# EAGLE design Dot (EAGLE 7.7.0)

## Sheet 1 of 2
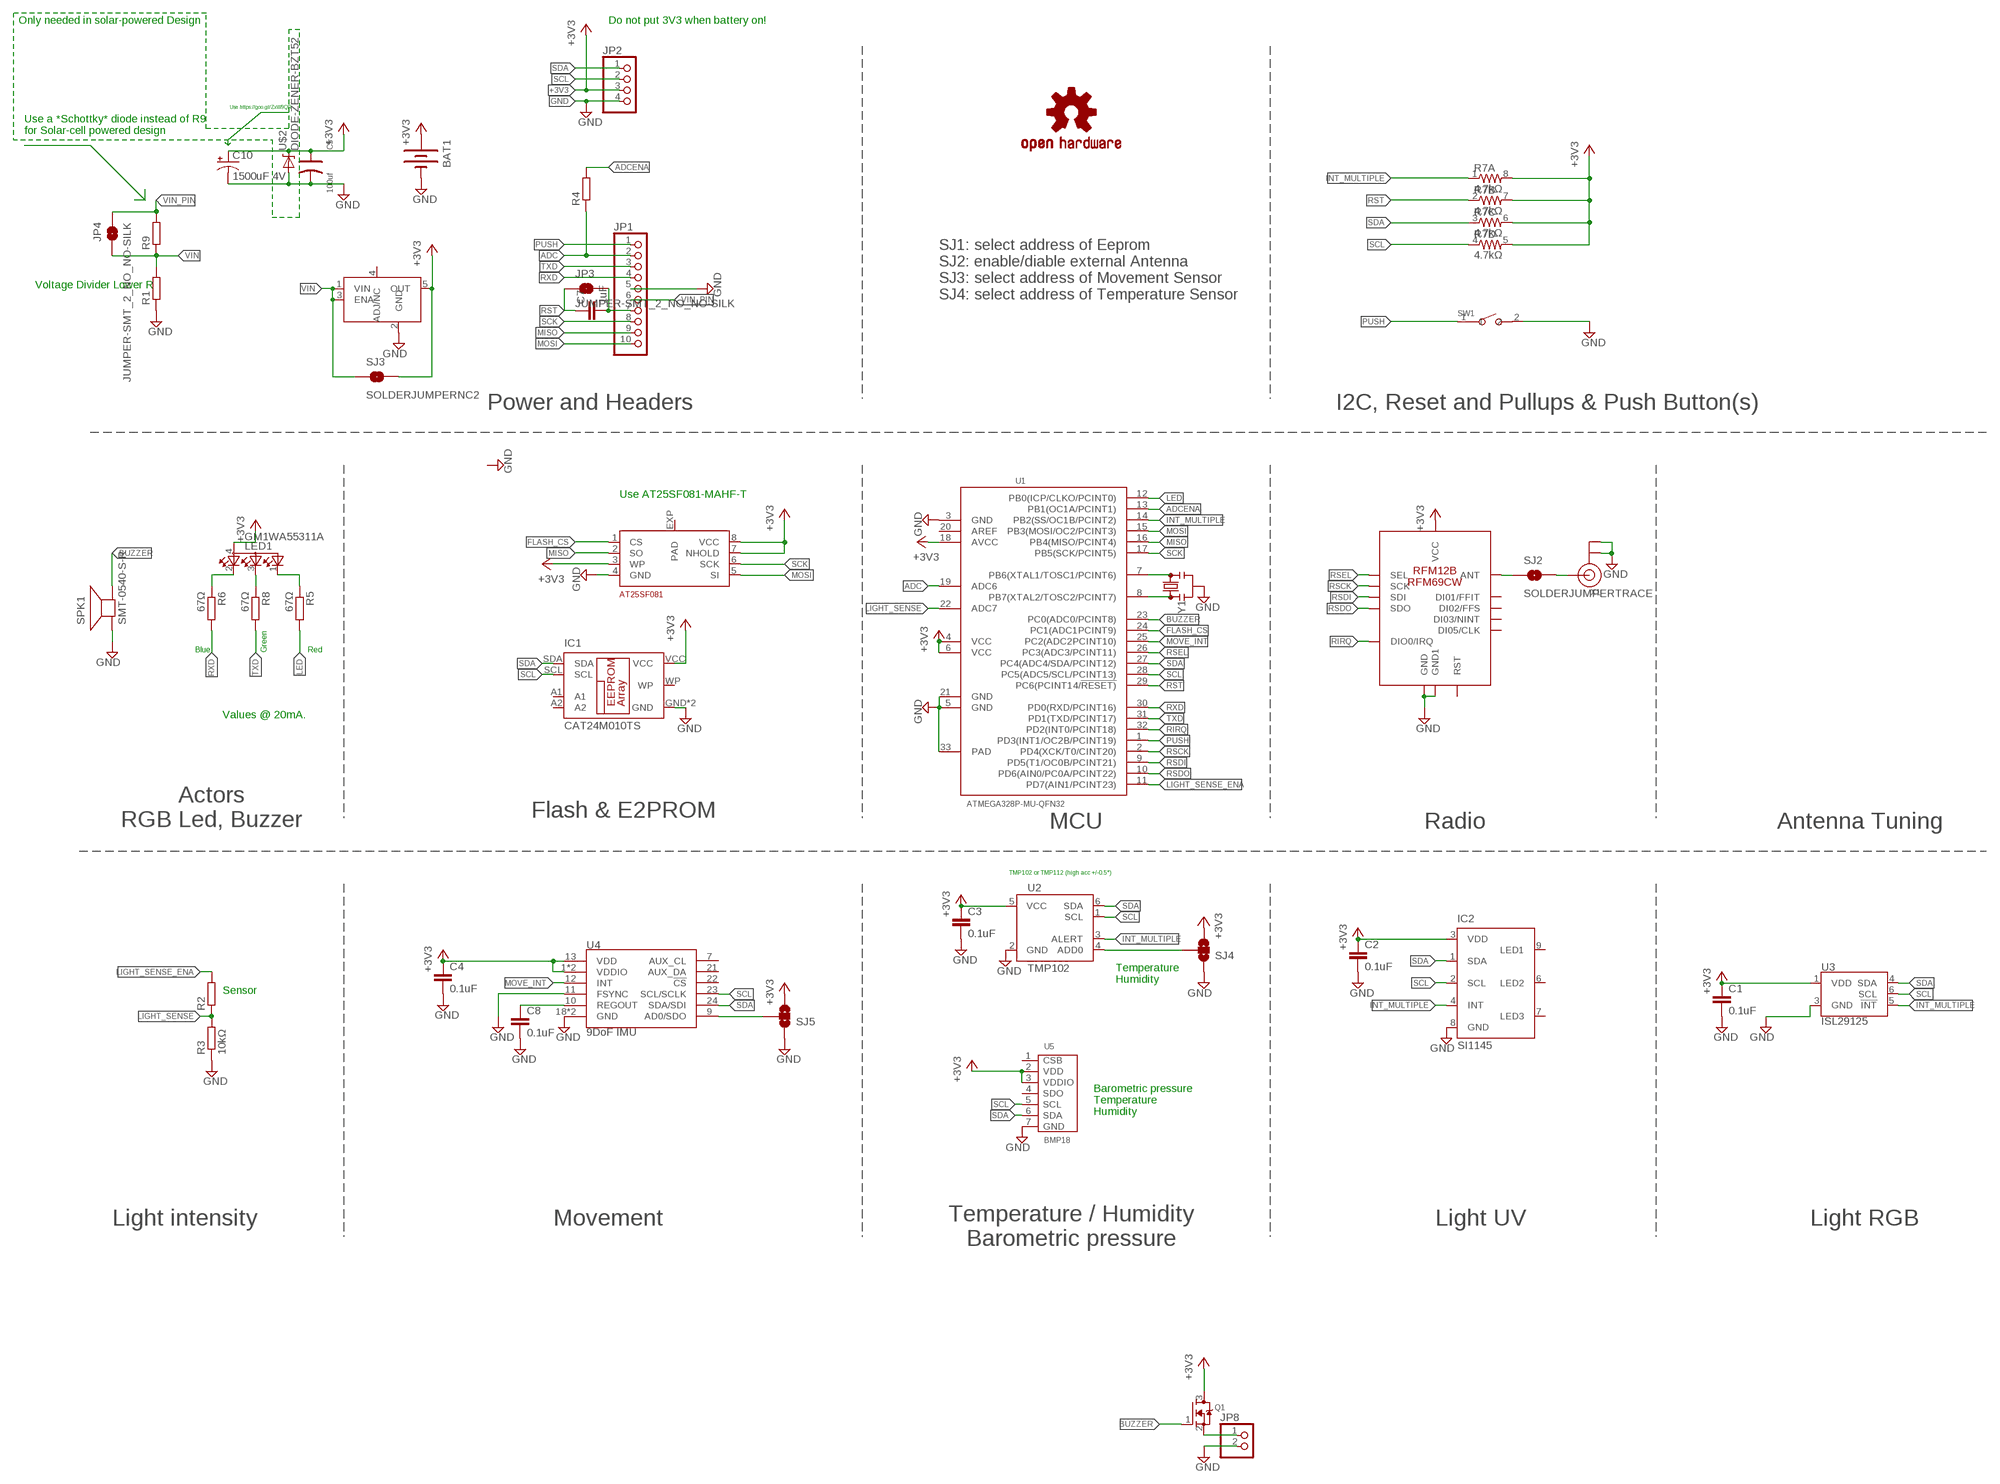
[diagram p0: schematic, sheet 1]

### Parts
BAT1  BATTERY20PTH  [BATTCOM_20MM_PTH]
C1  0.1uF  C-EUC0603  [C0603]
C2  0.1uF  C-EUC0603  [C0603]
C3  0.1uF  C-EUC0603  [C0603]
C4  0.1uF  C-EUC0603  [C0603]
C5  100uf  TANTALUM-SMD-100UF-6.3V(AVX-A)  [AVX-A]
C7  1uF  C-EUC0603  [C0603]
C8  0.1uF  C-EUC0603  [C0603]
C10  1500uF 4V  CPOL-USCT7343  [CT7343]
IC1  CAT24M010TS  [TSSOP8]
IC2  SI1145  [QFN-10]
JP1  PINHD-1X10  [1X10]
JP2  PINHD-1X4  [1X04]
JP3  JUMPER-SMT_2_NO_NO-SILK  [SMT-JUMPER_2_NO_NO-SILK]
JP4  JUMPER-SMT_2_NO_NO-SILK  [SMT-JUMPER_2_NO_NO-SILK]
JP8  PINHD-1X2  [1X02]
LED1  GM1WA55311A  [GM1WA55311A]
LOGO1  OSHW-LOGOS  [OSHW-LOGO-S]
Q1  MOSFET-NREFLOW  [SOT23]
R1  R-EU_R0603  [R0603]
R2  R-EU_R0805  [R0805]
R3  10kΩ  R-EU_R0603  [R0603]
R4  R-EU_R0603  [R0603]
R5  67Ω  R-EU_R0603  [R0603]
R6  67Ω  R-EU_R0603  [R0603]
R7  4.7kΩ  RESISTOR-ARRAY0603-ARV  [0603-ARV]
R8  67Ω  R-EU_R0603  [R0603]
R9  R-EU_R0603  [R0603]
SJ2  SOLDERJUMPERTRACE  [SJ_2S-TRACE]
SJ3  SOLDERJUMPERNC2  [SJ_2S-NOTRACE]
SJ4  SOLDERJUMPER_2WAYS  [SJ_3]
SJ5  SOLDERJUMPER_2WAYS  [SJ_3]
SPK1  SMT-0540-S-R  [SMT-0540-S-R]
SW1  SMD-BUTTON(2P-6.0X3.0X2.5MM)-DHT-1163S  [SW2-4.0-6.0X3.0X2.5MM]
U1  ATMEGA328P-MU-QFN32  MCU-ATMEGA328P-MU(QFN32)  [QFN32G-0.5-5X5MM]
U2  TMP102  [SOT563]
U3  ISL29125  [ODFN-6]
U4  9DoF IMU  MPU-9250  [QFN24-3X3]
U5  BMP18  PRESSURE-BMP180(LGA7)  [LGA7-1.5-3.8X3.6MM]
U$1  RFM12B/69CW  [RFM12B/69CW]
U$2  DIODE-ZENER-BZT52  [SOD-323]
U$3  AT25SF081  [DFN-2X3]
U$4  LDCL015  [SOT23-5]
X1  ANTENNA_U.FL  [U.FL]
Y1  RESONATORSMD-3.2X1.3  [RESONATOR-SMD-3.2X1.3]

### Nets
+3V3: BAT1.1(+) C1.1 C2.1 C3.1 C4.1 C5.+ C10.+ IC1.VCC IC2.3(VDD) JP2.3 LED1.4(A) Q1.3(D) R7.5 R7.6 R7.7 R7.8 SJ3.2 SJ4.3 SJ5.3 U1.4(VCC) U1.6(VCC) U1.18(AVCC) U2.5(VCC) U3.1(VDD) U4.1(VDDIO) U4.8(VDDIO) U4.13(VDD) U5.2(VDD) U5.3(VDDIO) U$1.VDD(VCC) U$2.1(C) U$3.3(WP) U$3.7(NHOLD) U$3.8(VCC) U$4.5(OUT)
ADC: JP1.2 R4.1 U1.19(ADC6)
ADCENA: R4.2 U1.13(PB1(OC1A/PCINT1))
BUZZER: Q1.1(G) SPK1.+(-) U1.23(PC0(ADC0/PCINT8))
FLASH_CS: U1.24(PC1(ADC1PCINT9)) U$3.1(CS)
GND: BAT1.2(-) C1.2 C2.2 C3.2 C4.2 C5.- C8.2 C10.- IC1.GND IC1.NC(GND) IC2.8(GND) JP1.5 JP2.4 JP8.2 R1.1 R3.1 SJ4.1 SJ5.1 SPK1.-(+) SW1.2 U1.3(GND) U1.5(GND) U1.21(GND) U1.33(PAD) U2.2(GND) U3.3(GND) U4.11(FSYNC) U4.18(GND) U4.20(GND) U5.7(GND) U$1.GND U$1.GND1 U$2.2(A) U$3.4(GND) U$4.2(GND) X1.1(GND) X1.2(GND) Y1.2
INT_MULTIPLE: IC2.4(INT) R7.1 U1.14(PB2(SS/OC1B/PCINT2)) U2.3(ALERT) U3.5(!INT)
LED: R5.2 U1.12(PB0(ICP/CLKO/PCINT0))
LIGHT_SENSE: R2.1 R3.2 U1.22(ADC7)
LIGHT_SENSE_ENA: R2.2 U1.11(PD7(AIN1/PCINT23))
MISO: JP1.9 U1.16(PB4(MISO/PCINT4)) U$3.2(SO)
MOSI: JP1.10 U1.15(PB3(MOSI/OC2/PCINT3)) U$3.5(SI)
MOVE_INT: U1.25(PC2(ADC2PCINT10)) U4.12(INT)
N$1: LED1.3(CBLUE) R8.1
N$3: SJ2.1 U$1.ANT
N$4: LED1.2(CRED) R6.1
N$5: C7.2 JP1.7 JP3.2
N$6: U1.7(PB6(XTAL1/TOSC1/PCINT6)) Y1.3
N$7: SJ2.2 X1.3(SIGNAL)
N$8: U1.8(PB7(XTAL2/TOSC2/PCINT7)) Y1.1
N$10: SJ4.2 U2.4(ADD0)
N$11: C8.1 U4.10(REGOUT)
N$14: SJ5.2 U4.9(AD0/SDO)
N$15: LED1.1(CGREEN) R5.1
N$16: JP8.1 Q1.2(S)
PUSH: JP1.1 SW1.1 U1.1(PD3(INT1/OC2B/PCINT19))
RIRQ: U1.32(PD2(INT0/PCINT18)) U$1.IRQ(DIO0/IRQ)
RSCK: U1.2(PD4(XCK/T0/CINT20)) U$1.SCK
RSDI: U1.9(PD5(T1/OC0B/PCINT21)) U$1.SDI
RSDO: U1.10(PD6(AIN0/PC0A/PCINT22)) U$1.SDO
RSEL: U1.26(PC3(ADC3/PCINT11)) U$1.SEL
RST: C7.1 JP3.1 R7.2 U1.29(PC6(PCINT14/!RESET))
RXD: JP1.4 R6.2 U1.30(PD0(RXD/PCINT16))
SCK: JP1.8 U1.17(PB5(SCK/PCINT5)) U$3.6(SCK)
SCL: IC1.SCL IC2.2(SCL) JP2.2 R7.4 U1.28(PC5(ADC5/SCL/PCINT13)) U2.1(SCL) U3.6(SCL) U4.23(SCL/SCLK) U5.5(SCL)
SDA: IC1.SDA IC2.1(SDA) JP2.1 R7.3 U1.27(PC4(ADC4/SDA/PCINT12)) U2.6(SDA) U3.4(SDA) U4.24(SDA/SDI) U5.6(SDA)
TXD: JP1.3 R8.2 U1.31(PD1(TXD/PCINT17))
VIN: JP4.2 R1.2 R9.1 SJ3.1 U$4.1(VIN) U$4.3(ENA)
VIN_PIN: JP1.6 JP4.1 R9.2
Unconnected: IC1.A1 IC1.A2 IC1.WP IC2.6(LED2) IC2.7(LED3) IC2.9(LED1) U1.20(AREF) U4.7(AUX_CL) U4.21(AUX_DA) U4.22(!CS) U5.1(CSB) U5.4(SDO) U$1.CLK(DI05/CLK) U$1.FFIT(DI01/FFIT) U$1.FFS(DI02/FFS) U$1.NINT(DI03/NINT) U$1.RST U$3.EXP(PAD) U$4.4(ADJ/NC)

### Notes on the sheet
- Only needed in solar-powered Design | Do not put 3V3 when battery on!
- Use https://goo.gl/ZxW9QR
- Use a *Schottky* diode instead of R9
  for Solar-cell powered design
- Voltage Divider Lower R
- SJ1: select address of Eeprom
  SJ2: enable/diable external Antenna
  SJ3: select address of Movement Sensor
  SJ4: select address of Temperature Sensor
- Power and Headers | I2C, Reset and Pullups & Push Button(s)
- Use AT25SF081-MAHF-T
- Blue | Green | Red
- Values @ 20mA.
- Actors
  RGB Led, Buzzer
- Flash & E2PROM
- MCU | Radio | Antenna Tuning
- TMP102 or TMP112 (high acc +/-0.5°)
- Temperature
  Humidity
- Sensor
- Barometric pressure
  Temperature
  Humidity
- Light intensity | Movement
- Temperature / Humidity
  Barometric pressure
- Light UV | Light RGB

## Sheet 2 of 2
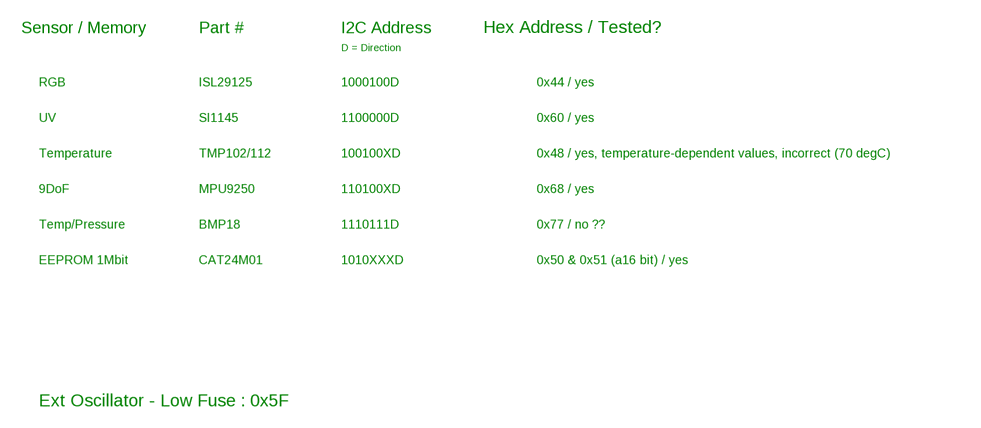
[diagram p1: schematic, sheet 2]

### Notes on the sheet
- Sensor / Memory | Part # | I2C Address | Hex Address / Tested?
- D = Direction
- RGB | ISL29125 | 1000100D | 0x44 / yes
- UV | SI1145 | 1100000D | 0x60 / yes
- Temperature | TMP102/112 | 100100XD | 0x48 / yes, temperature-dependent values, incorrect (70 degC)
- 9DoF | MPU9250 | 110100XD | 0x68 / yes
- Temp/Pressure | BMP18 | 1110111D | 0x77 / no ??
- EEPROM 1Mbit | CAT24M01 | 1010XXXD | 0x50 & 0x51 (a16 bit) / yes
- Ext Oscillator - Low Fuse : 0x5F

## Library data of the parts
BAT1 = Battery:BATTERY: Battery Holders Various common sizes : AA, AAA, 20mm coin cell and 12mm coin cell.
C1-C4 C7 C8 = resistor:C-EU: CAPACITOR, European symbol
C5 = Seeed-OPL-Capacitor:TANTALUM-SMD-100UF-6.3V(AVX-A): 302020003; MPN: TLJA107M006R0800
C10 = adafruit:CPOL-US: POLARIZED CAPACITOR, American symbol
IC1 = CAT24M01YI:CAT24M01: Serial EEPROM 1Mb, I2C; MF: On Semiconductor; MPN: 24C00T-E/ST
IC2 = silabs:SI114*: PROXIMITY/UV/AMBIENT LIGHT SENSOR IC WITH I2C INTERFACE Source: http://www.silabs.com/Support%20Documents/TechnicalDocs/Si1145-46-47.pdf
JP1 = pinhead:PINHD-1X10: PIN HEADER
JP2 = pinhead:PINHD-1X4: PIN HEADER
JP3 JP4 = SparkFun-Jumpers:JUMPER-SMT_2_NO: Normally open jumper This jumper has two pads in close proximity to each other. Apply solder to close the connection. Round pads are easier to solder for beginners, but are a lot larger. SparkFun Product that uses the round pads: SparkFun EL Sequencer <https://www.sparkfun.com/products/12781>
JP8 = pinhead:PINHD-1X2: PIN HEADER
LED1 = led:GM1WA55311A: Chip LED RGB Source: http://document.sharpsma.com/files/GM1WA55311A_SS.pdf
LOGO1 = Particle-Devices:OSHW-LOGO: Open Source Hardware Logo This logo indicates the piece of hardware it is found on incorporates a OSHW license and/or adheres to the definition of open source hardware found here: http://freedomdefined.org/OSHW
Q1 = adafruit:MOSFET-N: N-Channel Mosfet 2N7002E - 60V 260mA SOT23 [Digikey: 2N7002ET1GOSTR-ND] - REEL BSH103 - 30V 850mA SOT23 [Digikey: 568-5013-1-ND]
R1-R6 R8 R9 = resistor:R-EU_: RESISTOR, European symbol
R7 = SparkFun:RESISTOR-ARRAY: Array Chip Resistor Source: RS Component / Phycomp
SJ2 SJ3 = SparkFun:SOLDERJUMPER: Solder Jumper Standard SMD solder jumper. Used to automate production. Two varients : Normally Open and Normally Closed are the same, but have different paste layers. NC will have a large amount of paste and should jumper during reflow.
SJ4 SJ5 = SparkFun:SOLDERJUMPER_2WAY: Solder Jumper 2 way solder jumper
SPK1 = adafruit:SMT-0540-S-R: SMT-0549-S-R Small surface-mount magnetic buzzer
SW1 = Seeed-OPL-Switch:SMD-BUTTON(2P-6.0X3.0X2.5MM): 311020029
U1 = Seeed-OPL-ic:MCU-ATMEGA328P-MU(QFN32): 310010005; MPN: ATMEGA328P-MU
U2 = SparkFun:TMP102
U3 = SparkFun-Sensors:ISL29125: Intersil ISL29125 RGB Color Light Sensor The ISL29125 is a low power, high sensitivity, RED, GREEN and BLUE color light sensor (RGB) with an I2C (SMBus compatible) interface. Its state-of-the-art photodiode array provides an accurate RGB spectral response and excellent light source to light source variation (LS2LS). Datasheet <https://cdn.sparkfun.com/datasheets/Sensors/LightImaging/isl29125.pdf> SparkFun Products SparkFun RGB Light Sensor - ISL29125 <https://www.sparkfun.com/products/12829> (SEN-12829); PROD_ID: IC-12055
U4 = SparkFun-Sensors:MPU-9250: MPU-9250 9 Degree of Freedom IMU System in Package that contains MPU-6500 & AK8963 NC pin 19. 2-6 & 14-17 not internally connected. May be used for PCB trace routing. Datasheet <https://cdn.sparkfun.com/assets/learn_tutorials/5/5/0/MPU9250REV1.0.pdf> SparkFun Products: SparkFun 9DoF Razor IMU M0 <https://www.sparkfun.com/products/14001> SparkFun IMU Breakout - MPU-9250 <https://www.sparkfun.com/products/13762>; PROD_ID: IC-13192
U5 = Seeed-OPL-sensor:PRESSURE-BMP180(LGA7): 314030004; MPN: BMP18
U$1 = rfm12b_withoutPlanes:RFM12B/69CW
U$2 = SparkFun:DIODE-ZENER: Zener Diode Production Part - 8199 3.4V Zener Voltage
U$3 = AT25SF081:AT25SF081
U$4 = LDCL015:LDCL015
X1 = adafruit:ANTENNA_U.FL: U.FL Antenna Connector
Y1 = SparkFun-Clocks:RESONATOR: Resonators (Generic) Ceramic resonators are clock-generating components, often used to control timing in microcontrollers. They usually have 3 pins: two pins for oscillation, and one pin for ground. Compared to crystals, resonators have worse tolerance, but are usually much cheaper. Plus, they have built-in load capacitors! These devices are used on boards like the Arduino Pro 8MHz <https://www.sparkfun.com/products/11114> and Arduino Pro 16MHz <https://www.sparkfun.com/products/11113>.

## Board
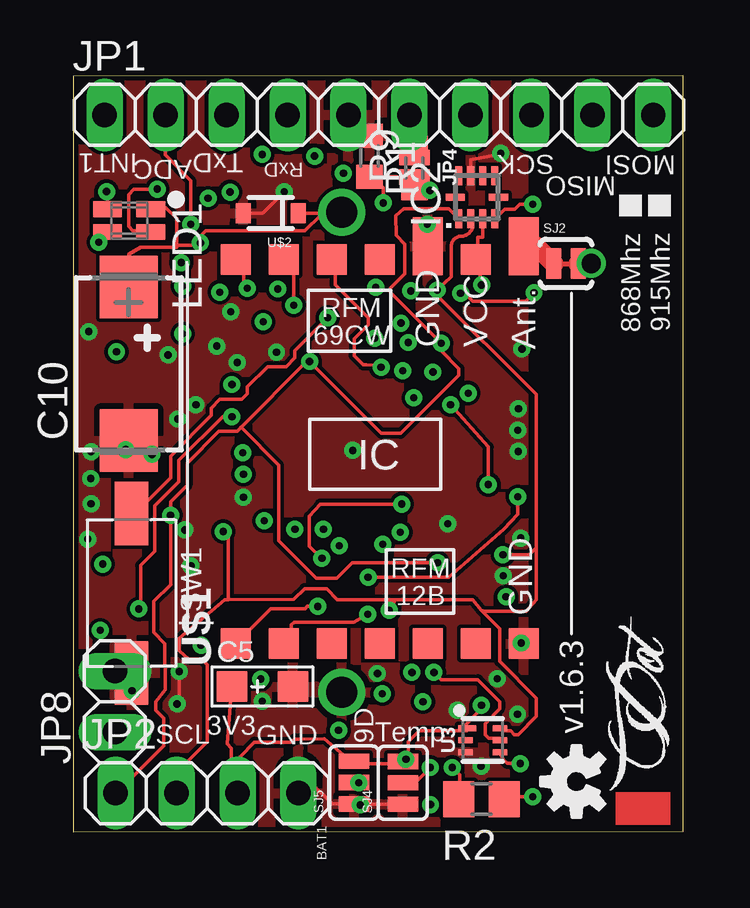
[diagram p2: board, top side]
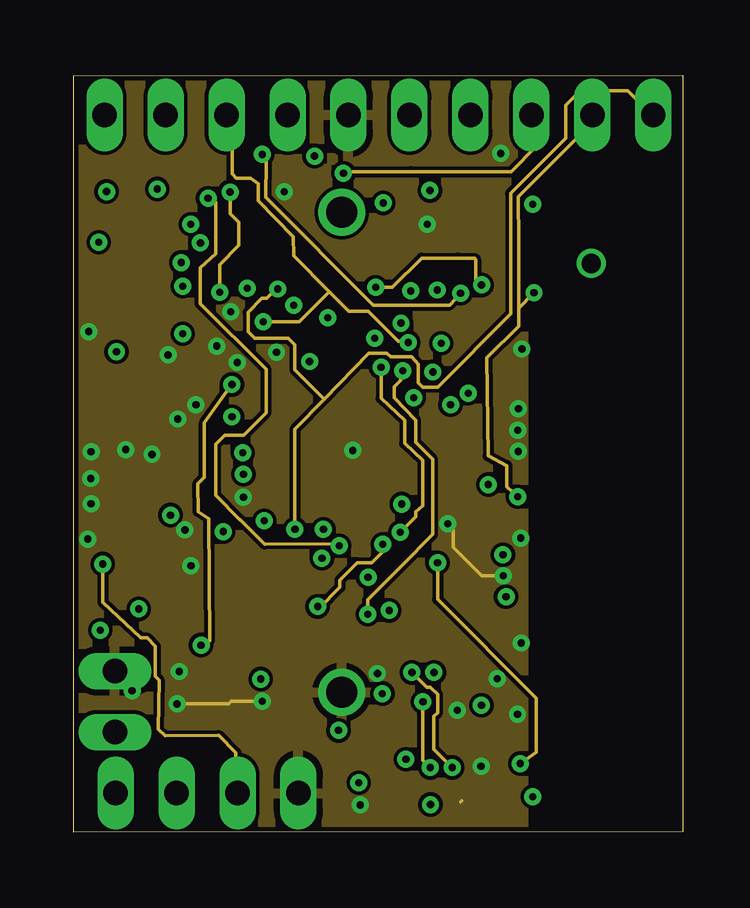
[diagram p3: board, inner layer Route2]
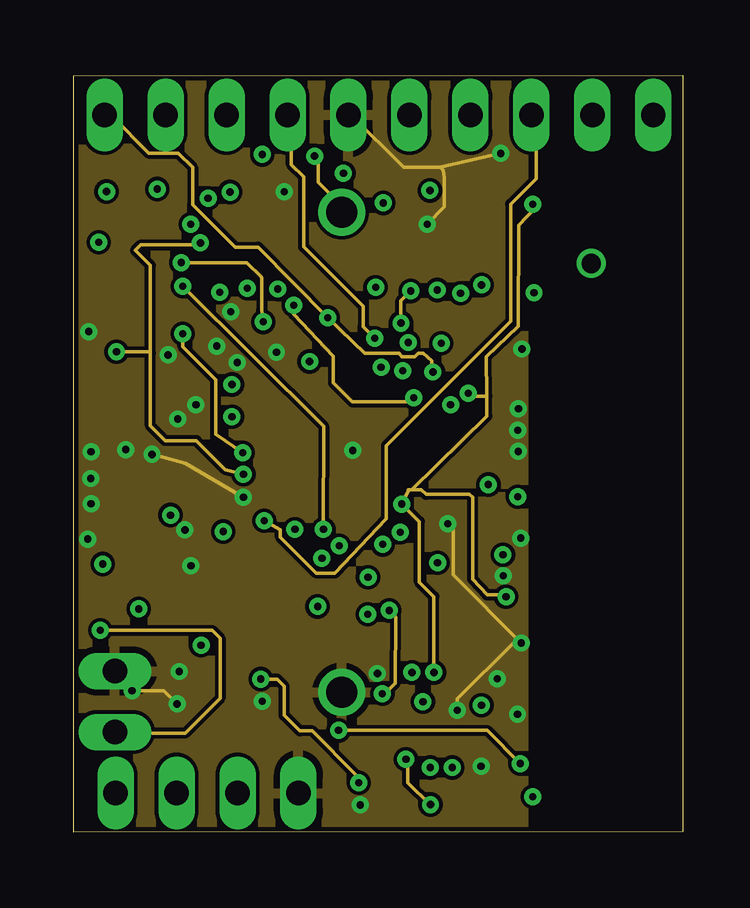
[diagram p4: board, inner layer Route15]
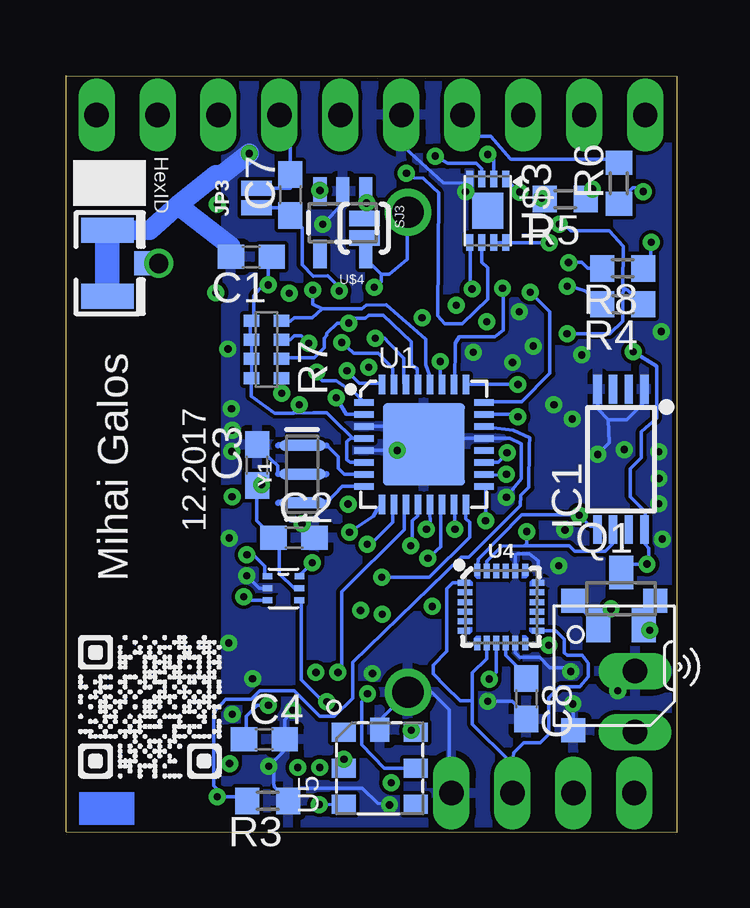
[diagram p5: board, bottom side, seen from below]

Size 25.43 x 31.52 mm. Coordinates in mm from the lower left corner, seen from the top.
Outline: 25.43,0.02 25.42,31.52 0,31.5 0,0
Outline: 25.43,0.02 0,0
Copper layers ((1*2)*(15*16)): Top 0.035mm / dielectric 1.5mm / Route2 0.035mm / dielectric 0.15mm / Route15 0.035mm / dielectric 0.2mm / Bottom 0.035mm
Design rules "default *": minimum track width 6mil, minimum drill 0.3mm, track to track 6mil, track to pad 6mil, pad to pad 6mil, via to via 6mil, smd to smd 6mil, copper to edge 8mil, drill to drill 8mil, minimum pad ring 10mil, minimum via ring 8mil, stop-mask expansion 4mil, vias tented up to drill 0mil, thermal gap 10mil

### Footprints (pad centres in the part's own frame; a part is rotated, then mirrored left to right if it is on the bottom)
BATTCOM_20MM_PTH = drill 1.3: 1 20,0; 2 0,0
C0603 = smd 1.1 x 1: 1 -0.85,0; 2 0.85,0
AVX-A = smd 1.27 x 1.27: + -1.27,0; - 1.27,0
CT7343 = smd 2.6 x 2.4: + 3.2,0; - -3.2,0
TSSOP8 = smd 1.2 x 0.35: A1 -2.925,1.595; A2 -2.925,0.945; GND -2.925,0.295; NC -2.925,2.245; SCL 2.925,0.945; SDA 2.925,0.295; VCC 2.925,2.245; WP 2.925,1.595
QFN-10 = smd 0.8 x 0.3: 1 -0.9,0.75; 2 -0.9,0.25; 3 -0.9,-0.25; 4 -0.9,-0.75; 6 0.9,-0.75; 7 0.9,-0.25; 8 0.9,0.25; 9 0.9,0.75 | smd 0.3 x 0.8: 5 0,-0.9; 10 0,0.9
1X10 = drill 1.016 long: 1 -11.43,0; 2 -8.89,0; 3 -6.35,0; 4 -3.81,0; 5 -1.27,0; 6 1.27,0; 7 3.81,0; 8 6.35,0; 9 8.89,0; 10 11.43,0
1X04 = drill 1.016 long: 1 -3.81,0; 2 -1.27,0; 3 1.27,0; 4 3.81,0
SMT-JUMPER_2_NO_NO-SILK = smd 0.635 x 1.27: 1 -0.406,0; 2 0.406,0
1X02 = drill 1.016 long: 1 -1.27,0; 2 1.27,0
GM1WA55311A = smd 0.65 x 1.2: 1 0.477,0.9; 2 -0.475,-0.9; 3 0.475,-0.9; 4 -0.477,0.9
SOT23 = smd 1 x 1.4: 1 -0.95,-1.1; 2 0.95,-1.1; 3 0,1.1
R0603 = smd 1 x 1.1: 1 -0.85,0; 2 0.85,0
R0805 = smd 1.3 x 1.5: 1 -0.95,0; 2 0.95,0
0603-ARV = smd 0.5 x 0.65: 1 -1.2,-0.625; 2 -0.4,-0.625; 3 0.4,-0.625; 4 1.2,-0.625; 5 1.2,0.625; 6 0.4,0.625; 7 -0.4,0.625; 8 -1.2,0.625
SJ_2S-TRACE = smd 0.635 x 1.27: 1 -0.508,0; 2 0.508,0
SJ_2S-NOTRACE = smd 0.635 x 1.27: 1 -0.401,0; 2 0.413,0
SJ_3 = smd 0.635 x 1.27: 1 -0.889,0; 2 0,0; 3 0.889,0
SMT-0540-S-R = smd 1 x 1: + 1.7,-2.7; - 1.7,2.7; M -1.7,-2.7
SW2-4.0-6.0X3.0X2.5MM = smd 2.65 x 1.4: 1 -3.325,0; 2 3.325,0
QFN32G-0.5-5X5MM = smd 0.813 x 0.279: 1 -2.5,1.75; 2 -2.5,1.25; 3 -2.5,0.75; 4 -2.5,0.25; 5 -2.5,-0.25; 6 -2.5,-0.75; 7 -2.5,-1.25; 8 -2.5,-1.75; 17 2.5,-1.75; 18 2.5,-1.25; 19 2.5,-0.75; 20 2.5,-0.25; 21 2.5,0.25; 22 2.5,0.75; 23 2.5,1.25; 24 2.5,1.75 | smd 0.279 x 0.813: 9 -1.75,-2.5; 10 -1.25,-2.5; 11 -0.75,-2.5; 12 -0.25,-2.5; 13 0.25,-2.5; 14 0.75,-2.5; 15 1.25,-2.5; 16 1.75,-2.5; 25 1.75,2.5; 26 1.25,2.5; 27 0.75,2.5; 28 0.25,2.5; 29 -0.25,2.5; 30 -0.75,2.5; 31 -1.25,2.5; 32 -1.75,2.5 | smd 3.429 x 3.429: 33 0,0
SOT563 = smd 0.25 x 0.4: 1 -0.5,-0.66; 2 0,-0.66; 3 0.5,-0.66; 4 0.5,0.66; 5 0,0.66; 6 -0.5,0.67
ODFN-6 = smd 0.75 x 0.25: 1 -0.645,0.5 | smd 0.6 x 0.25: 2 -0.72,0; 3 -0.72,-0.5; 4 0.72,-0.5; 5 0.72,0; 6 0.72,0.5
QFN24-3X3 = smd 0.495 x 0.25: 1 -1.552,1; 6 -1.552,-1; 13 1.552,-1; 18 1.552,1 | smd 0.6 x 0.25: 2 -1.5,0.6; 3 -1.5,0.2; 4 -1.5,-0.2; 5 -1.5,-0.6; 14 1.5,-0.6; 15 1.5,-0.2; 16 1.5,0.2; 17 1.5,0.6 | smd 0.25 x 0.495: 7 -1,-1.552; 12 1,-1.552; 19 1,1.552; 24 -1,1.552 | smd 0.25 x 0.6: 8 -0.6,-1.5; 9 -0.2,-1.5; 10 0.2,-1.5; 11 0.6,-1.5; 20 0.6,1.5; 21 0.2,1.5; 22 -0.2,1.5; 23 -0.6,1.5
LGA7-1.5-3.8X3.6MM = smd 0.8 x 1: 1 1.5,1.5; 2 0,1.5; 3 -1.5,1.5; 4 -1.5,-1.5; 5 0,-1.5; 6 1.5,-1.5 | smd 1 x 0.8: 7 1.6,0
RFM12B/69CW = smd 2.413 x 1.27: ANT 9.06,-6; GND 9.06,-2 | smd 1.27 x 1.27: CLK -7.5,-2; FFIT -7.5,0; FFS -7.5,2; GND1 -7.5,-6; IRQ -7.5,4; NINT 8.5,0; RST -7.5,-4; SCK 8.5,4; SDI 8.5,2; SDO -7.5,6; SEL 8.5,6; VDD 8.5,-4
SOD-323 = smd 0.63 x 0.83: 1 -1.15,0; 2 1.15,0
DFN-2X3 = smd 0.7 x 0.3: 1 -1.325,0.75; 2 -1.325,0.25; 3 -1.325,-0.25; 4 -1.325,-0.75; 5 1.325,-0.75; 6 1.325,-0.25; 7 1.325,0.25; 8 1.325,0.75 | smd 1.5 x 1.3: EXP 0,0
SOT23-5 = smd 0.55 x 1.2: 1 -0.95,-1.3; 2 0,-1.3; 3 0.95,-1.3; 4 0.95,1.3; 5 -0.95,1.3
U.FL = smd 2.2 x 1.05: 1 0,1.375; 2 0,-1.375 | smd 0.8 x 1: 3 1.525,0
RESONATOR-SMD-3.2X1.3 = smd 0.45 x 1.905: 1 -1.2,0; 2 0,0; 3 1.2,0

### Placement (x,y rotation side)
BAT1  11.19,5.84 90 top
C1  17.72,23.98 180 bottom
C2  15.94,12.27 0 bottom
C3  17.47,15.31 90 bottom
C4  17.18,3.88 0 bottom
C5  7.88,6.08 0 top
C7  16.09,26.56 90 bottom
C8  6.26,5.57 270 bottom
C10  2.31,19.52 90 top
IC1  3.59,15.55 270 bottom
IC2  16.82,26.46 90 top
JP1  12.74,29.9 0 top
JP2  5.58,1.64 0 top
JP3  17.5,26.43 90 bottom
JP4  14.22,27.72 270 top
JP8  1.73,5.45 90 top
LED1  2.33,25.49 270 top
LOGO1  20.97,2.12 90 top
Q1  2.31,9.73 0 bottom
R1  12.34,28.18 270 top
R2  17.01,1.39 180 top
R3  17.03,1.32 180 bottom
R4  2.24,22.01 180 bottom
R5  4.64,26.39 180 bottom
R6  2.41,27.05 90 bottom
R7  17.09,20.13 90 bottom
R8  2.25,23.5 180 bottom
R9  14.21,27.69 90 top
SJ2  20.53,23.7 0 top
SJ3  13.01,25.18 270 bottom
SJ4  13.73,2.07 90 top
SJ5  11.7,2.08 90 top
SPK1  2.6,6.95 180 bottom
SW1  2.43,9.97 270 top
U1  10.53,16.17 0 bottom
U2  16.38,10.17 270 bottom
U3  17.06,3.85 0 top
U4  7.32,9.4 0 bottom
U5  12.37,2.68 90 bottom
U$1  12.77,15.37 90 top
U$2  8.23,25.81 180 top
U$3  7.86,25.9 270 bottom
U$4  13.91,25.41 180 bottom
X1  23.72,23.72 0 bottom
Y1  15.6,14.93 90 bottom

### Tracks (layer width: path | path; a pad name or v marks a point on that pad's centre or on a via)
+3V3  (via drill 0.3)
  Top 0.152: 16.09,4.23 14.42,4.23 13.96,3.77 13.96,3.46 | 16.09,4.23 16.4,4.23 U3.1 16.09,4.23 | 13.96,3.46 13.96,3.16 13.81,3.01 SJ4.3 13.66,2.86 11.83,2.86 SJ5.3 11.52,3.01 10.46,3.9 10.47,3.9 9.37,3.89 9.22,3.89 9.07,3.76 7.55,3.76 6.95,3.16 6.95,2.54 | v17.01,5.3 17.01,5.14 16.09,4.23 | 6.95,2.54 6.95,2.1 JP2.3 | v17.01,22.81 17.01,22.85 16.86,23.74 U$1.VDD 16.86,23.89 16.86,24.8 17.07,24.8 IC2.3 | 5.4,24.94 5.53,25.06 8.95,25.06 9.65,25.06 10.3,25.72 11.07,25.72 BAT1.1 | 5.4,24.94 5.27,24.8 5.28,24.47 4.31,24.46 4.32,24.39 | 11.07,25.87 BAT1.1 | v5.3,24.56 5.31,24.82 5.4,24.94 | v13.86,3.05 13.95,3.4 13.96,3.46 | 4.32,24.39 4.31,25.58 3.86,26.04 LED1.4 | C5.+ 6.42,3.68 6.59,3.51 6.59,2.9 6.95,2.54 | v17.3,14.49 17.3,16.07 v15.72,17.82 | 4.32,24.39 2.82,24.39 2.31,24.08 C10.+ | U$2.1 11.06,25.79 BAT1.1
  Route2 0.152: v12.6,22.72 13.3,22.72 14.51,23.93 16.02,23.93 16.03,23.93 16.72,23.92 U$1.VDD 16.77,23.05 v17.01,22.81 | v1.23,11.18 1.23,9.58 2.81,8.1 3.07,8.1 3.42,7.75 3.42,6.5 3.44,6.48 3.57,6.34 3.53,4.29 3.82,4.02 6.06,4.04 6.78,3.32 6.78,1.71 JP2.3
  Route15 0.152: v14.89,1.16 13.94,2.07 13.93,2.07 13.93,3.26 v13.86,3.05 | v7.09,14.93 6.34,15.11 5.13,16.33 3.82,16.33 3.21,16.94 3.21,19.98 | 3.21,19.98 3.21,23.63 2.59,24.25 2.82,24.48 5.21,24.48 v5.3,24.56 | v1.8,20.03 3.16,20.03 3.21,19.98 | v10.05,28.18 10.21,28.24 10.21,27.08 11.19,26.1 BAT1.1
  Bottom 0.152: v17.01,5.3 17.47,5.3 17.92,4.84 17.92,3.92 C4.1 | JP2.3 6.8,2.1 6.8,3.16 6.78,3.32 6.36,3.74 5.68,3.74 5.32,4.09 5.33,4.1 5.33,5.61 4.88,6.06 4.04,6.06 3.68,6.49 3.68,7.06 3.93,7.37 4.56,7.37 4.68,7.49 4.68,8.05 5.04,8.41 U4.13 | U2.5 15.79,10.17 15.94,10.17 16.55,10.78 16.55,12.03 C2.1 17.5,12.98 17.5,14.45 17.53,14.45 C3.1 17.31,14.46 17.25,14.52 17.27,14.52 v17.3,14.49 | 13.54,16.46 14.27,17.18 14.58,17.49 15.14,17.49 15.95,17.47 | 13.54,16.46 13.5,16.42 13.05,16.42 U1.4 | 17.01,24.04 C1.1 | 17.11,22.96 17.01,22.97 17.01,23.89 C1.1 | 17.11,22.96 17.62,22.37 17.62,21.45 R7.5 17.77,21.3 17.77,20.54 R7.6 R7.7 R7.8 17.73,18.91 17.73,18.18 16.74,17.47 15.95,17.47 | 17.11,22.96 v17.01,22.81 | 12.31,23.26 11.97,23.26 11.23,23.88 11.23,25.7 11.22,25.72 BAT1.1 10.65,26.39 | 16.86,24.04 C1.1 | U5.2 13.87,2.82 SJ4.3 13.73,3.04 v13.86,3.05 | U5.3 14.1,1.18 v14.89,1.16 | 12.31,23.26 12.96,23.9 U$4.5 12.96,24.76 SJ3.2 | U1.18 7.3,14.89 v7.09,14.93 | 6.89,2.02 JP2.3 | U4.8 7.92,7.25 8.51,6.65 8.51,5.48 | 8.51,5.48 8.51,4.51 6.95,2.96 6.95,2.11 JP2.3 | U4.1 9.33,10.4 9.57,10.16 9.57,7.54 10.14,6.97 10.14,6.6 9.64,6.1 9.64,6.09 9.03,5.48 8.51,5.48 | 12.31,23.26 12.31,22.94 v12.6,22.72 | v15.72,17.82 15.95,17.47 | v1.8,20.03 0.84,19.42 0.84,17.26 1.47,16.7 1.47,15.61 1.93,15.16 1.93,13.99 1.31,13.37 1.31,12.76 IC1.VCC 1.31,12.61 1.31,12 1.16,11.85 1.16,11.26 v1.23,11.18 1.96,11.18 Q1.3 | U$3.7 U$3.8 5.32,24.58 v5.3,24.56 | U$3.3 8.12,27.64 8.35,27.87 9.54,27.87 v10.05,28.18 | U1.6 13.6,15.42 13.74,15.53 13.74,16.28 13.54,16.46
ADC  (via drill 0.3)
  Top 0.152: v4.89,25.34 4.9,27.15 3.83,28.24 3.83,29.88 JP1.2
  Route15 0.152: v7.06,15.82 5.94,16.59 5.94,18.86 4.57,20.24 v4.57,20.78
  Bottom 0.152: 2.24,22.69 2.21,22.58 2.24,22.49 2.25,21.3 2.78,20.79 4.21,20.79 v4.57,20.78 | U1.19 7.44,15.42 v7.06,15.82 | 2.24,22.69 2.23,24.42 2.82,25.08 4.42,25.08 4.66,25.32 v4.89,25.34 | 2.24,22.69 2.03,22.59 R4.1
ADCENA  (via drill 0.3)
  Route15 0.152: v10.43,12.63 10.43,16.92 v4.56,22.76
  Bottom 0.152: v10.43,12.63 10.27,12.71 10.29,13.56 U1.13 | v4.56,22.76 4.5,22.75 4.5,22.78 3.82,22.56 R4.2
BUZZER  (via drill 0.3)
  Top 0.152: v6.61,17.32 6.22,17.32 4.4,15.5 4.4,14.61 3.4,13.61 3.4,11.72 2.81,11.12 2.81,9.39 v2.73,9.31
  Bottom 0.152: U1.23 6.74,17.42 v6.61,17.32 | v2.73,9.31 2.78,9.31 Q1.1 3.38,8.73 SPK1.+
FLASH_CS  (via drill 0.3)
  Route2 0.152: v6.1,22.51 6.1,23.66 6.9,24.46 6.9,25.42 6.54,25.78 6.54,26.65 v6.53,26.68
  Bottom 0.152: U1.24 7.96,17.94 6.46,17.94 5.28,19.13 5.28,21.69 v6.1,22.51 | v6.53,26.68 6.55,26.67 U$3.1
GND  (via drill 0.3)
  Top 0.152: JP2.4 9.94,2.03 10.78,1.19 SJ5.1 11.83,1.33 12.28,1.33 12.28,1.18 | 13.33,1.18 SJ4.1 12.28,1.18 | SW1.2 2.48,6.69 | IC2.8 16.55,27.36 16.56,28.03 17.78,28.26 v17.81,28.29 | U$1.GND 14.77,25.32 v14.75,25.35 | U$1.GND1 18.76,7.87 v18.67,7.89 | JP1.5 11.45,29.88 11.45,28.61 11.45,28.56 R1.1 | v11.96,1.15 12.32,1.15 12.28,1.18 | v2.45,5.9 2.43,5.92 SW1.2 | v4.41,6.71 4.41,5.44 v4.33,5.35 | U$2.2 7.91,25.81 v8.79,26.69 | JP8.2 2.38,6.69 SW1.2
  Route2 0.152: R3.1 16.15,1.28 | v17.92,10.7 17.02,10.7 15.83,11.89 15.83,12.89 | v7.87,5.47 6.59,5.47 6.47,5.35 v4.33,5.35
  Route15 0.152: v16,5.09 16,5.56 18.32,7.89 v18.67,7.89 15.83,10.73 15.83,12.79 v15.61,12.86 | v3.28,15.75 4.66,15.38 v7.09,13.96 6.79,14.04 | v4.33,5.35 3.78,5.9 v2.45,5.9 | JP1.5 11.57,29.9 13.76,27.71 15.27,27.71 v17.81,28.29 | 15.29,27.72 15.41,27.59 15.47,27.29 15.46,26.06 v14.75,25.35
  Bottom 0.152: 6.69,10.92 U4.20 6.72,11.58 6.61,11.62 6.14,11.62 5.76,11.31 U4.18 | v16,5.09 16,5.02 16.33,4.69 C4.2 16.33,3.42 16.78,2.96 16.78,1.99 16.77,1.97 16.77,1.9 R3.1 15.65,1.85 13.09,1.85 12.46,1.21 v11.96,1.15 | v11.65,15.92 10.53,15.92 U1.33 10.46,16.27 10.3,16.42 8.17,16.42 U1.21 6.95,16.42 6.47,16.2 6.47,15.59 6.47,14.74 v7.09,13.96 | IC1.NC 1.34,17.93 2.07,17.2 2.84,17.2 2.84,17.19 | 2.84,17.19 3.29,17.64 IC1.GND | v3.28,15.75 2.82,16.24 2.84,17.19 | C2.2 15.83,12.9 15.6,12.85 15.61,12.85 15.67,12.87 v15.61,12.86 | U2.2 17.39,10.17 v17.92,10.7 | v11.65,15.92 U1.5 | U1.3 11.62,16.92 11.62,16.89 11.65,16.89 v11.65,15.92 | U5.7 12.37,4.67 BAT1.2 10.21,5.84 9.48,5.12 9.48,2.49 9.42,2.49 JP2.4 9.43,2.02 | SPK1.- 4.3,5.33 v4.33,5.35 | U$4.2 13.91,26.19 v14.75,25.35 | U4.11 6.72,7.48 6.53,7.3 5.73,7.3 5.73,7.29 5.71,7.29 5.28,6.87 4.57,6.87 v4.4,6.7 v4.41,6.7 v4.41,6.71 | C8.2 6.36,4.82 6.36,4.98 6.85,5.47 v7.87,5.47 | C3.2 17.52,16.04 17.45,16.04 16.61,15.28 16.61,14.93 | JP1.5 11.47,29.12 11.45,29.1 11.35,29.1 11.42,29 11.33,28.52 9.73,27.06 8.74,27.05 8.61,27.05 U$3.4 8.79,27.05 v8.79,26.69
  Bottom 0.406: C1.2 18.57,24.42
  Bottom 0.813: X1.1 21.95,25.1 20.78,26.13 | 20.78,26.13 19.2,27.4 18.96,27.4 v17.81,28.29 | 18.57,24.42 20.78,26.13
  Bottom 1.016: X1.1 X1.2
  other vias: 18.55,17.66 18.54,15.88 18.65,12.27 6.84,19.58 8.47,20 6.56,21.69 12.67,6.62 18.52,16.76 18.7,20.14 3.95,19.9 5.11,17.82 4.36,17.23 2.19,15.95 16.99,2.75 5.98,20.26 0.74,13.7 0.74,14.75 0.74,15.87 0.6,12.22 4.91,11.11 4.65,12.6 17.67,6.4 18.51,4.92 0.64,20.87
  pour Top: 0.27,0.01 18.77,0.01 18.77,32.01 0.27,32.01
  pour Route2: 0.27,0.01 18.77,0.01 18.77,32.01 0.27,32.01
  pour Route15: 0.27,0.01 18.77,0.01 18.77,32.01 0.27,32.01
  pour Bottom: 0.27,0.01 18.77,0.01 18.77,32.01 0.27,32.01
INT_MULTIPLE  (via drill 0.3)
  Top 0.152: IC2.4 17.98,25.97 18.41,25.97 18.61,26.18 v19.14,26.18 | v15.03,6.67 15.33,6.36 16.86,6.36 17.77,5.45 17.77,5.14 17.16,4.53 17.16,4.08 17.31,3.92 17.77,3.92 U3.5 | v13.69,13.68 10.29,13.68 9.83,13.17 9.83,11.93 v10.36,11.42
  Route15 0.152: v19.14,26.18 19.29,26.02 19.24,26.02 18.56,25.3 18.54,21.1 17.22,19.81 17.23,18.18 | 17.23,18.18 17.24,17.35 14.11,14.29 | 13.97,14.29 14.11,14.29 | v16.46,18.3 16.69,18.18 17.23,18.18 | v18.03,9.82 17.96,9.9 17.25,9.9 16.64,10.56 16.64,13.96 16.51,14.09 14.71,14.09 14.51,14.29 14.11,14.29 | 13.96,14.29 13.97,14.29 | 13.97,14.29 v13.69,13.68 14.43,12.95 14.43,10.43 15.03,9.83 v15.03,6.67
  Bottom 0.152: R7.1 16.46,18.28 v16.46,18.3 | U2.3 17.83,9.67 v18.03,9.82 | v10.36,11.42 9.83,11.9 9.83,13.59 U1.14
LED  (via drill 0.3)
  Route2 0.152: v11.08,11.94 11.31,11.88 11.05,12.02 7.97,12.02 6.95,13.03 5.93,14.05 5.93,16.18 6.31,16.55 7.1,16.55 8.03,17.49 8.03,19.29 5.29,22.04 5.29,23.52 5.94,24.11 5.94,26.25 v5.62,26.42
  Bottom 0.152: U1.12 10.78,13.2 11.01,12.98 11.01,12.03 v11.08,11.94 | v5.62,26.42 5.48,26.77 5.39,26.71 5.4,26.48 R5.2
LIGHT_SENSE  (via drill 0.3)
  Top 0.152: v19.14,1.49 18.08,1.49 R2.1
  Bottom 0.152: 18.99,1.64 18.84,1.49 18.08,1.49 17.92,1.33 R3.2 | 18.99,1.64 19.29,1.94 19.29,4.99 18.78,5.54 17.72,5.54 17.37,5.91 15.94,5.91 14.88,4.84 14.27,4.84 13.5,5.6 13.5,7.09 8.96,11.47 8.66,11.46 6.51,13.61 6.5,14.06 6.15,14.37 6.15,16.11 6.13,16.44 6.8,16.76 7.83,16.89 U1.22 | 18.99,1.64 v19.14,1.49
LIGHT_SENSE_ENA  (via drill 0.3)
  Top 0.152: v15.79,2.71 16.09,2.4 16.09,1.49 R2.2
  Route2 0.152: v14.11,6.67 14.72,6.06 14.88,6.06 15.18,5.75 15.18,4.99 15.03,4.84 15.03,3.47 v15.79,2.71
  Bottom 0.152: v14.11,6.67 13.96,6.82 13.96,10.02 11.34,12.62 11.34,13.53 U1.11
MISO  (via drill 0.3)
  Top 0.152: v12.28,10.63 15.64,10.63 17.93,12.64 18.53,13.26 v18.53,13.98 | v16.14,22.47 16.3,22.47 16.64,22.12 18.85,22.13 v19.2,22.48
  Route2 0.152: v18.53,13.98 18.07,14.4 18.07,15.28 17.29,15.68 17.24,19.77 18.55,21.09 18.55,21.85 | 18.55,21.85 18.55,25.21 18.53,25.87 18.53,26.48 21.58,29.53 21.58,29.83 JP1.9 | v7.87,28.25 8.04,27.93 8.04,27.95 8.02,26.46 12.51,21.97 15.69,21.97 v16.14,22.47 | v19.2,22.48 v19.19,22.48 18.55,21.85
  Bottom 0.152: v12.28,10.63 10.3,10.63 8.63,12.31 8.63,12.92 8.78,13.07 8.78,13.53 U1.16 | v7.87,28.25 7.84,28.25 7.61,28.02 U$3.2
MOSI  (via drill 0.3)
  Route2 0.152: v9.24,12.64 9.23,16.79 10.46,18.05 | 10.46,18.05 12.32,19.96 13.07,19.97 13.23,19.82 14.11,19.81 14.39,19.52 14.39,18.74 14.57,18.56 15.18,18.56 18.23,21.6 18.23,26.63 20.51,28.92 20.51,30.29 21.12,30.9 23.1,30.9 24.02,29.99 JP1.10 | v8.52,22.64 8.45,22.66 8.06,22.25 7.86,22.25 7.28,21.67 7.28,20.86 7.55,20.59 8.96,20.59 9.23,20.32 9.23,19.27 10.46,18.05
  Bottom 0.152: v9.24,12.64 9.24,13.53 U1.15 | U$3.5 8.6,22.77 8.52,22.69 v8.52,22.64
MOVE_INT  (via drill 0.3)
  Route2 0.152: v5.33,7.81 5.3,7.85 5.68,7.99 5.64,13.06 5.2,13.37 5.2,14.53 5.46,14.8 5.46,17.07 v6.61,18.66
  Bottom 0.152: U4.12 5.89,7.85 v5.33,7.81 | v6.61,18.66 U1.25
N$1  (via drill 0.3)
  Top 0.152: v1.06,24.59 1.13,24.97 LED1.3
  Bottom 0.152: R8.1 1.43,23.5 1.07,23.82 v1.07,24.6 v1.06,24.59
N$3
  Top 0.813: U$1.ANT 19.3,24.43 SJ2.1
N$4  (via drill 0.3)
  Top 0.152: LED1.2 1.45,26.08 | 1.41,26.04 LED1.2 | v1.39,26.7 1.42,26.86 LED1.2
  Bottom 0.152: R6.1 2.41,26.29 1.83,26.87 1.42,26.87 v1.39,26.7
N$5
  Bottom 0.152: JP1.7 16.55,29.01 16.09,28.55 C7.2 16.09,26.84 JP3.2
N$6
  Bottom 0.152: U1.7 13.04,14.93 13.84,14.93 14.1,15.18 14.1,15.64 14.58,16.13
N$7  (via drill 0.8)
  Top 0.813: SJ2.2 v21.58,23.7 v21.58,23.71
  Bottom 0.813: v21.58,23.71 X1.3
N$8
  Bottom 0.152: U1.8 13.94,14.42 14.58,13.73
N$10  (via drill 0.3)
  Top 0.152: v14.88,2.71 14.27,2.1 13.81,2.1 SJ4.2
  Route2 0.152: v14.57,5.45 14.57,3.01 v14.88,2.71
  Bottom 0.152: v14.57,5.45 14.72,5.45 15.64,6.36 15.64,9.56 U2.4
N$11
  Bottom 0.152: 7.14,7.87 U4.10 7.12,7.38 6.37,6.63 C8.1
N$14  (via drill 0.3)
  Top 0.152: SJ5.2 11.77,2.08 v11.89,2.07
  Route15 0.152: v11.89,2.07 11.78,2.41 9.96,4.23 9.44,4.23 8.79,4.88 8.79,6.1 8.5,6.39 v7.81,6.39
  Bottom 0.152: U4.9 7.52,6.68 7.79,6.41 7.78,6.4 v7.81,6.39
N$15  (via drill 0.3)
  Top 0.152: v3.5,26.81 2.52,26.81 2.31,26.58 2.31,25.25 2.48,25.08 3.21,25.08 LED1.1
  Bottom 0.152: R5.1 3.79,26.58 v3.5,26.81
N$16  (via drill 0.3)
  Route15 0.152: v1.12,8.42 5.78,8.42 6.12,8.08 6.12,5.59 4.66,4.13 1.56,4.13 JP8.1
  Bottom 0.152: Q1.2 1.33,8.63 v1.12,8.42
PUSH  (via drill 0.3)
  Top 0.152: v10.61,21.45 9.24,20.08 9.24,19.77 8.88,19.41 8.11,19.41 7.25,18.56 7.25,18.28 7.02,18.05 6.11,18.05 5.74,17.68 5.74,17.38 4.07,15.67 4.07,14.77 2.7,13.43 2.84,13.37 2.53,13.37 SW1.1
  Route15 0.152: v14.99,19.19 14.93,19.13 14.93,19.65 14.58,19.96 14.37,19.96 14.22,19.82 13.7,19.82 13.58,19.97 12.14,19.96 v10.61,21.45 7.7,24.38 6.75,24.38 4.97,26.16 4.97,27.71 4.38,28.31 3.14,28.31 1.62,29.83 1.31,29.83 JP1.1
  Bottom 0.152: v14.99,19.19 14.97,19.02 14.78,18.82 14.19,18.82 13.35,18.25 13.05,17.95 U1.1
RIRQ  (via drill 0.3)
  Top 0.152: U$1.IRQ 9.12,8.03 9.08,7.43 9.08,8.66 9.21,8.77 11.69,8.77 v12.27,9.09
  Route2 0.152: v13.73,19.23 13.65,18.84 13.37,18.56 13.37,18.11 14.27,17.18 14.27,16.25 14.98,15.54 14.98,12.42 14.41,11.86 14.27,11.7 12.27,9.69 v12.27,9.09
  Bottom 0.152: v13.73,19.23 13.23,18.71 12.28,18.71 U1.32
RSCK  (via drill 0.3)
  Top 0.152: v9.18,21.97 9.18,23.69 8.78,23.74 U$1.SCK
  Route15 0.152: v14.19,18.12 14.09,17.94 11.63,17.94 10.84,18.73 10.84,19.84 9.18,21.59 v9.18,21.97
  Bottom 0.152: v14.19,18.12 13.76,17.42 13,17.42 U1.2
RSDI  (via drill 0.3)
  Top 0.152: v12.83,19.38 12.83,19.47 12.22,19.48 12.08,19.48 11.7,19.86 11.7,20.57 12.28,21.16 12.28,21.45 10.91,22.82 10.91,23.74 U$1.SDI
  Route2 0.152: v13.63,12.51 14.26,13.16 14.27,13.36 14.56,13.61 14.56,15.5 13.81,16.21 13.81,17.18 12.83,18.09 v12.83,19.38
  Bottom 0.152: v13.63,12.51 12.64,13.17 12.44,13.53 12.28,13.53 U1.9
RSDO  (via drill 0.3)
  Top 0.152: 7.06,7.61 7.14,8.03 U$1.SDO 8.23,9.33 9.66,9.33 9.75,9.42 v10.18,9.42
  Route2 0.152: v12.89,12 12.89,11.7 12.44,11.24 11.83,11.24 11.11,10.51 11.11,10.21 10.23,9.33 v10.18,9.42
  Bottom 0.152: v12.89,12 12.74,12 11.83,12.92 11.83,13.53 U1.10
RSEL  (via drill 0.3)
  Top 0.152: v7.26,22.67 7.1,22.82 7.1,23.43 6.8,23.74 U$1.SEL
  Bottom 0.152: v7.26,22.67 7.23,22.5 7.22,20.92 7.58,20.65 9.05,20.64 9.23,20.38 9.24,18.71 U1.26
RST  (via drill 0.3)
  Route15 0.152: v13.66,21.22 13.66,22.16 v14.06,22.56
  Bottom 0.152: R7.2 16.4,19.77 15.11,19.77 14.69,20.19 14.69,20.59 14.57,20.71 14.57,20.8 14.14,21.22 v13.66,21.22 13.64,21.24 13.64,21.25 13.47,21.42 12.97,21.42 12.84,21.55 12.23,21.55 11.05,20.44 11.05,19.47 10.81,19.32 10.81,18.71 U1.29 | v14.06,22.56 14.06,22.72 14.54,23.19 15.13,23.18 15.61,23.66 15.6,25.2 C7.1 16.09,26.03 JP3.1
RXD  (via drill 0.3)
  Route15 0.152: JP1.4 9.09,29.74 9.09,27.83 9.59,27.32 9.59,24.4 12.08,21.92 12.08,21.07 v12.56,20.59
  Bottom 0.152: v12.56,20.59 12.17,20.58 12.02,20.42 11.37,19.75 11.37,18.71 U1.30 | JP1.4 8.95,29.88 8.95,29.29 8.66,29 7.75,29.01 6.93,28.07 6.89,28.05 2.43,28.04 R6.2
SCK  (via drill 0.3)
  Route2 0.152: v11.26,27.47 11.3,27.52 14.08,27.53 18.24,27.53 19.29,28.58 | 19.29,28.46 19.29,28.58 | 19.29,28.58 19.29,29.69 JP1.8
  Route15 0.152: v7.96,12.99 8.62,12.61 8.63,12.31 10.13,10.81 10.91,10.8 13.05,13.07 13.05,16.12 18.23,21.3 18.23,26.18 19.29,27.24 19.29,29.68 19.14,29.83 JP1.8
  Bottom 0.152: v7.96,12.99 7.94,14.33 U1.17 | v11.26,27.47 10.93,27.27 10.55,27.26 10.16,26.89 9.91,26.64 9.94,21.53 9.65,21.2 8.93,21.2 7.87,22.22 7.87,23.52 8.11,23.76 U$3.6
SCL  (via drill 0.3)
  Top 0.152: U3.6 17.92,4.23 18.23,4.23 18.38,4.08 18.53,4.08 19.29,4.84 19.3,5.6 17.77,7.13 17.77,8.5 17.01,9.26 | 6.46,9.7 9.18,9.71 9.64,10.16 10.56,10.16 11,9.7 13.41,9.69 | 6.46,9.7 6.31,9.7 4.42,8.09 4.42,7.58 4.81,7.22 5.36,7.22 5.58,6.98 5.58,3.77 4.36,2.55 4.36,2.1 JP2.2 | 17.01,9.26 16.65,9.69 13.41,9.69 | 19.29,11.86 19.29,9.69 18.87,9.21 17.14,9.21 17.01,9.26 | 19.29,11.86 19.29,18.25 15.03,22.52 v15.16,22.6 15.75,23.15 15.75,24.37 arc-92 16.15,24.84 arc124 IC2.2 | v17.91,11.57 19,11.57 19.29,11.86 | v13.17,9.25 v13.17,9.24 13.41,9.69 | v6.25,12.54 6.46,12.54 6.46,9.7
  Route15 0.152: v12.88,5.78 12.89,5.7 13.41,6.21 13.43,8.96 v13.17,9.25
  Bottom 0.152: 14.77,21.81 13.12,21.81 12.93,21.96 12.09,21.98 10.46,20.54 10.46,19.49 10.3,19.02 10.3,18.87 10.3,18.71 U1.28 | 14.77,21.81 15.18,21.45 15.94,21.45 16.09,21.3 16.4,21.3 R7.4 | U2.1 17.16,10.78 17.16,11.09 17.62,11.54 17.89,11.54 v17.91,11.57 | 6.34,11.94 4.48,11.95 4.24,11.71 2.97,11.71 2.68,12 2.68,12.61 IC1.SCL | 6.34,11.94 7.28,11.93 7.91,11.3 7.91,10.92 U4.23 7.91,10.77 | v15.16,22.6 15.17,22.01 14.77,21.81 | U5.5 12.18,2.68 13.11,3.65 13.13,5.44 v12.88,5.78 | v6.25,12.54 6.25,12.03 6.34,11.94 | 4.35,2.02 JP2.2
SDA  (via drill 0.3)
  Top 0.152: v9.85,19.62 10.15,19.32 | 10.15,19.32 12.84,16.62 13.64,16.62 16.07,19.06 16.07,19.33 15.33,20.07 v15.33,20.38 13.2,22.52 13.2,22.67 13.81,23.28 13.81,24.5 13.45,24.88 13.45,25.69 13.76,25.99 14.94,25.99 15.45,25.99 15.51,25.98 15.47,25.98 15.66,25.98 IC2.1 | U3.4 17.91,3.04 17.92,3.04 18.08,2.88 v18.62,2.88 v18.63,2.87 | 10.15,19.32 9.85,19.61 9.71,19.61 6.99,16.87 | 6.99,16.87 6.84,16.71 6.06,16.71 4.74,15.39 4.75,14.46 4.05,13.77 v4.05,13.22 4.05,10.33 3.36,9.63 3.36,8.33 3.82,7.87 3.83,5.95 3.45,5.45 3.45,5.08 3.76,4.76 3.76,3.61 2.22,2.07 2.2,2.07 JP2.1 | v15.18,11.24 11.63,11.24 10.97,10.58 10.13,10.58 8.56,12.16 8.56,15.31 7.02,16.86 6.99,16.87
  Route2 0.152: v18.63,2.87 19.29,3.35 19.29,5.6 15.18,9.72 v15.18,11.24
  Route15 0.152: v11.06,4.25 17.25,4.25 v18.63,2.87
  Bottom 0.152: v15.18,11.24 15.64,10.78 U2.6 | v9.85,19.62 9.85,18.71 U1.27 | v15.33,20.38 15.64,20.69 15.94,20.69 16.09,20.54 16.4,20.54 R7.3 | IC1.SDA 3.45,12.76 3.6,12.76 v4.05,13.22 4.1,13.24 6.45,13.24 8.27,11.39 8.3,10.95 U4.24 | U5.6 11.06,4.18 v11.06,4.25
TXD  (via drill 0.3)
  Route2 0.152: v13.96,20.41 13.91,20.48 13.54,20.47 13.28,20.72 12.29,21.71 11.49,21.71 10.68,22.53 | 10.68,22.53 9.18,24.02 9.18,24.82 7.7,26.31 7.7,27.03 7.4,27.26 6.8,27.26 6.62,27.45 6.61,29.68 JP1.3 | v7.91,21.27 9.42,21.27 10.68,22.53
  Route15 0.152: v4.5,23.75 7.23,23.75 7.23,23.74 7.82,23.15 7.82,23.13 7.85,23.1 7.85,21.77 v7.91,21.27
  Bottom 0.152: U1.31 11.83,18.71 11.83,19.32 12.44,19.96 13.46,19.96 v13.96,20.41 | 6.4,29.12 6.4,29.88 JP1.3 | R8.2 3.7,23.5 3.95,23.75 v4.5,23.75
VIN  (via drill 0.3)
  Top 0.152: R9.1 13.5,27.32 R1.2 12.92,26.86 v12.92,26.23 | R9.1 14.45,26.84 v14.86,26.75 | R9.1 14.21,27.27 | JP4.2 14.22,26.85 R9.1
  Bottom 0.152: U$4.1 12.97,26.72 12.97,26.28 v12.92,26.23 12.92,25.58 SJ3.1 | v14.86,26.75 14.83,26.73 U$4.3
VIN_PIN
  Top 0.152: R9.2 14.01,28.54 JP1.6 | R9.2 14.11,28.54 | JP4.1 R9.2
(copper drawn outside any net)
  shapes: Bottom area x1, Top area x1

### Text on the board
tPlace: INT1 | ADC | TxD | SCK | MOSI | RxD | MISO | 868Mhz | 915Mhz | v1.6.3 | 3V3 | GND | SCL | 9D | Temp
bPlace: HexID | Mihai Galos | 12.2017